# EasyEDA schematic 20210526-8-channel-solid-relay.json

## Sheets
1 SolidRelays: TITLE: Sheet_1; REV: 1.0; Date: 2021-05-26; Sheet: 1/1; Drawn By: Suresh Kumar Gadi; Company: Your Company
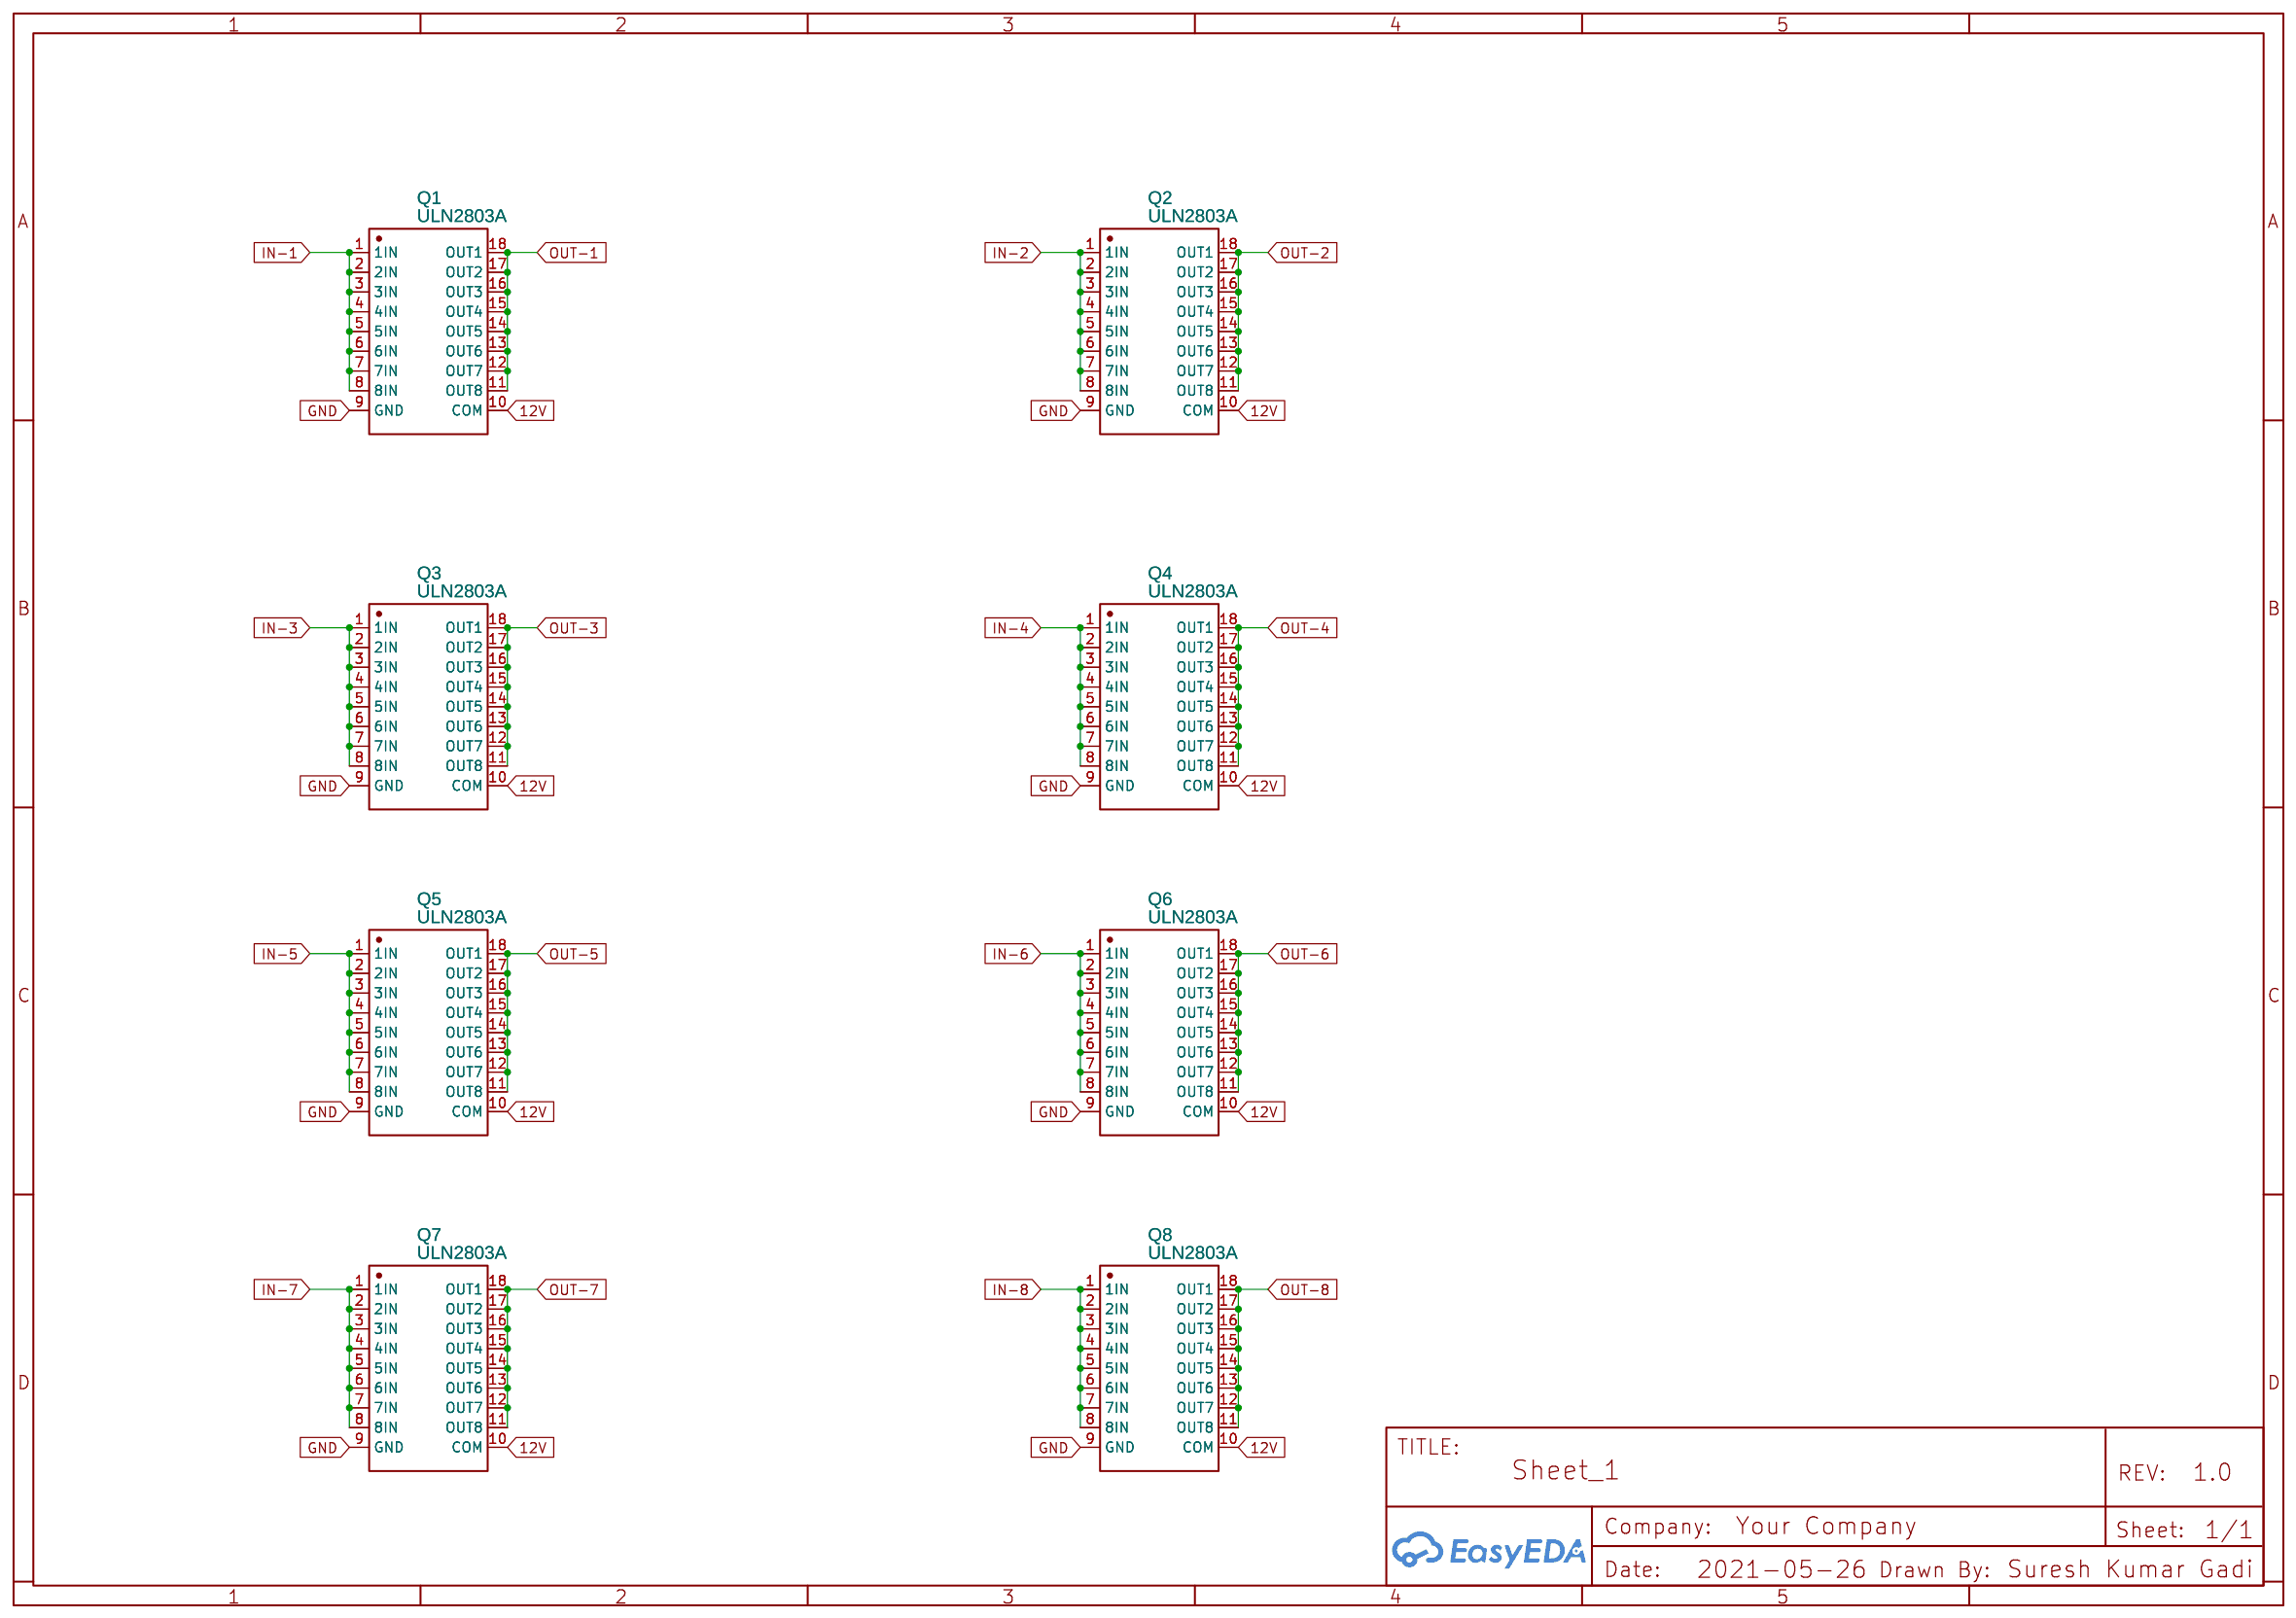
[diagram p0: SolidRelays]
2 Connectors
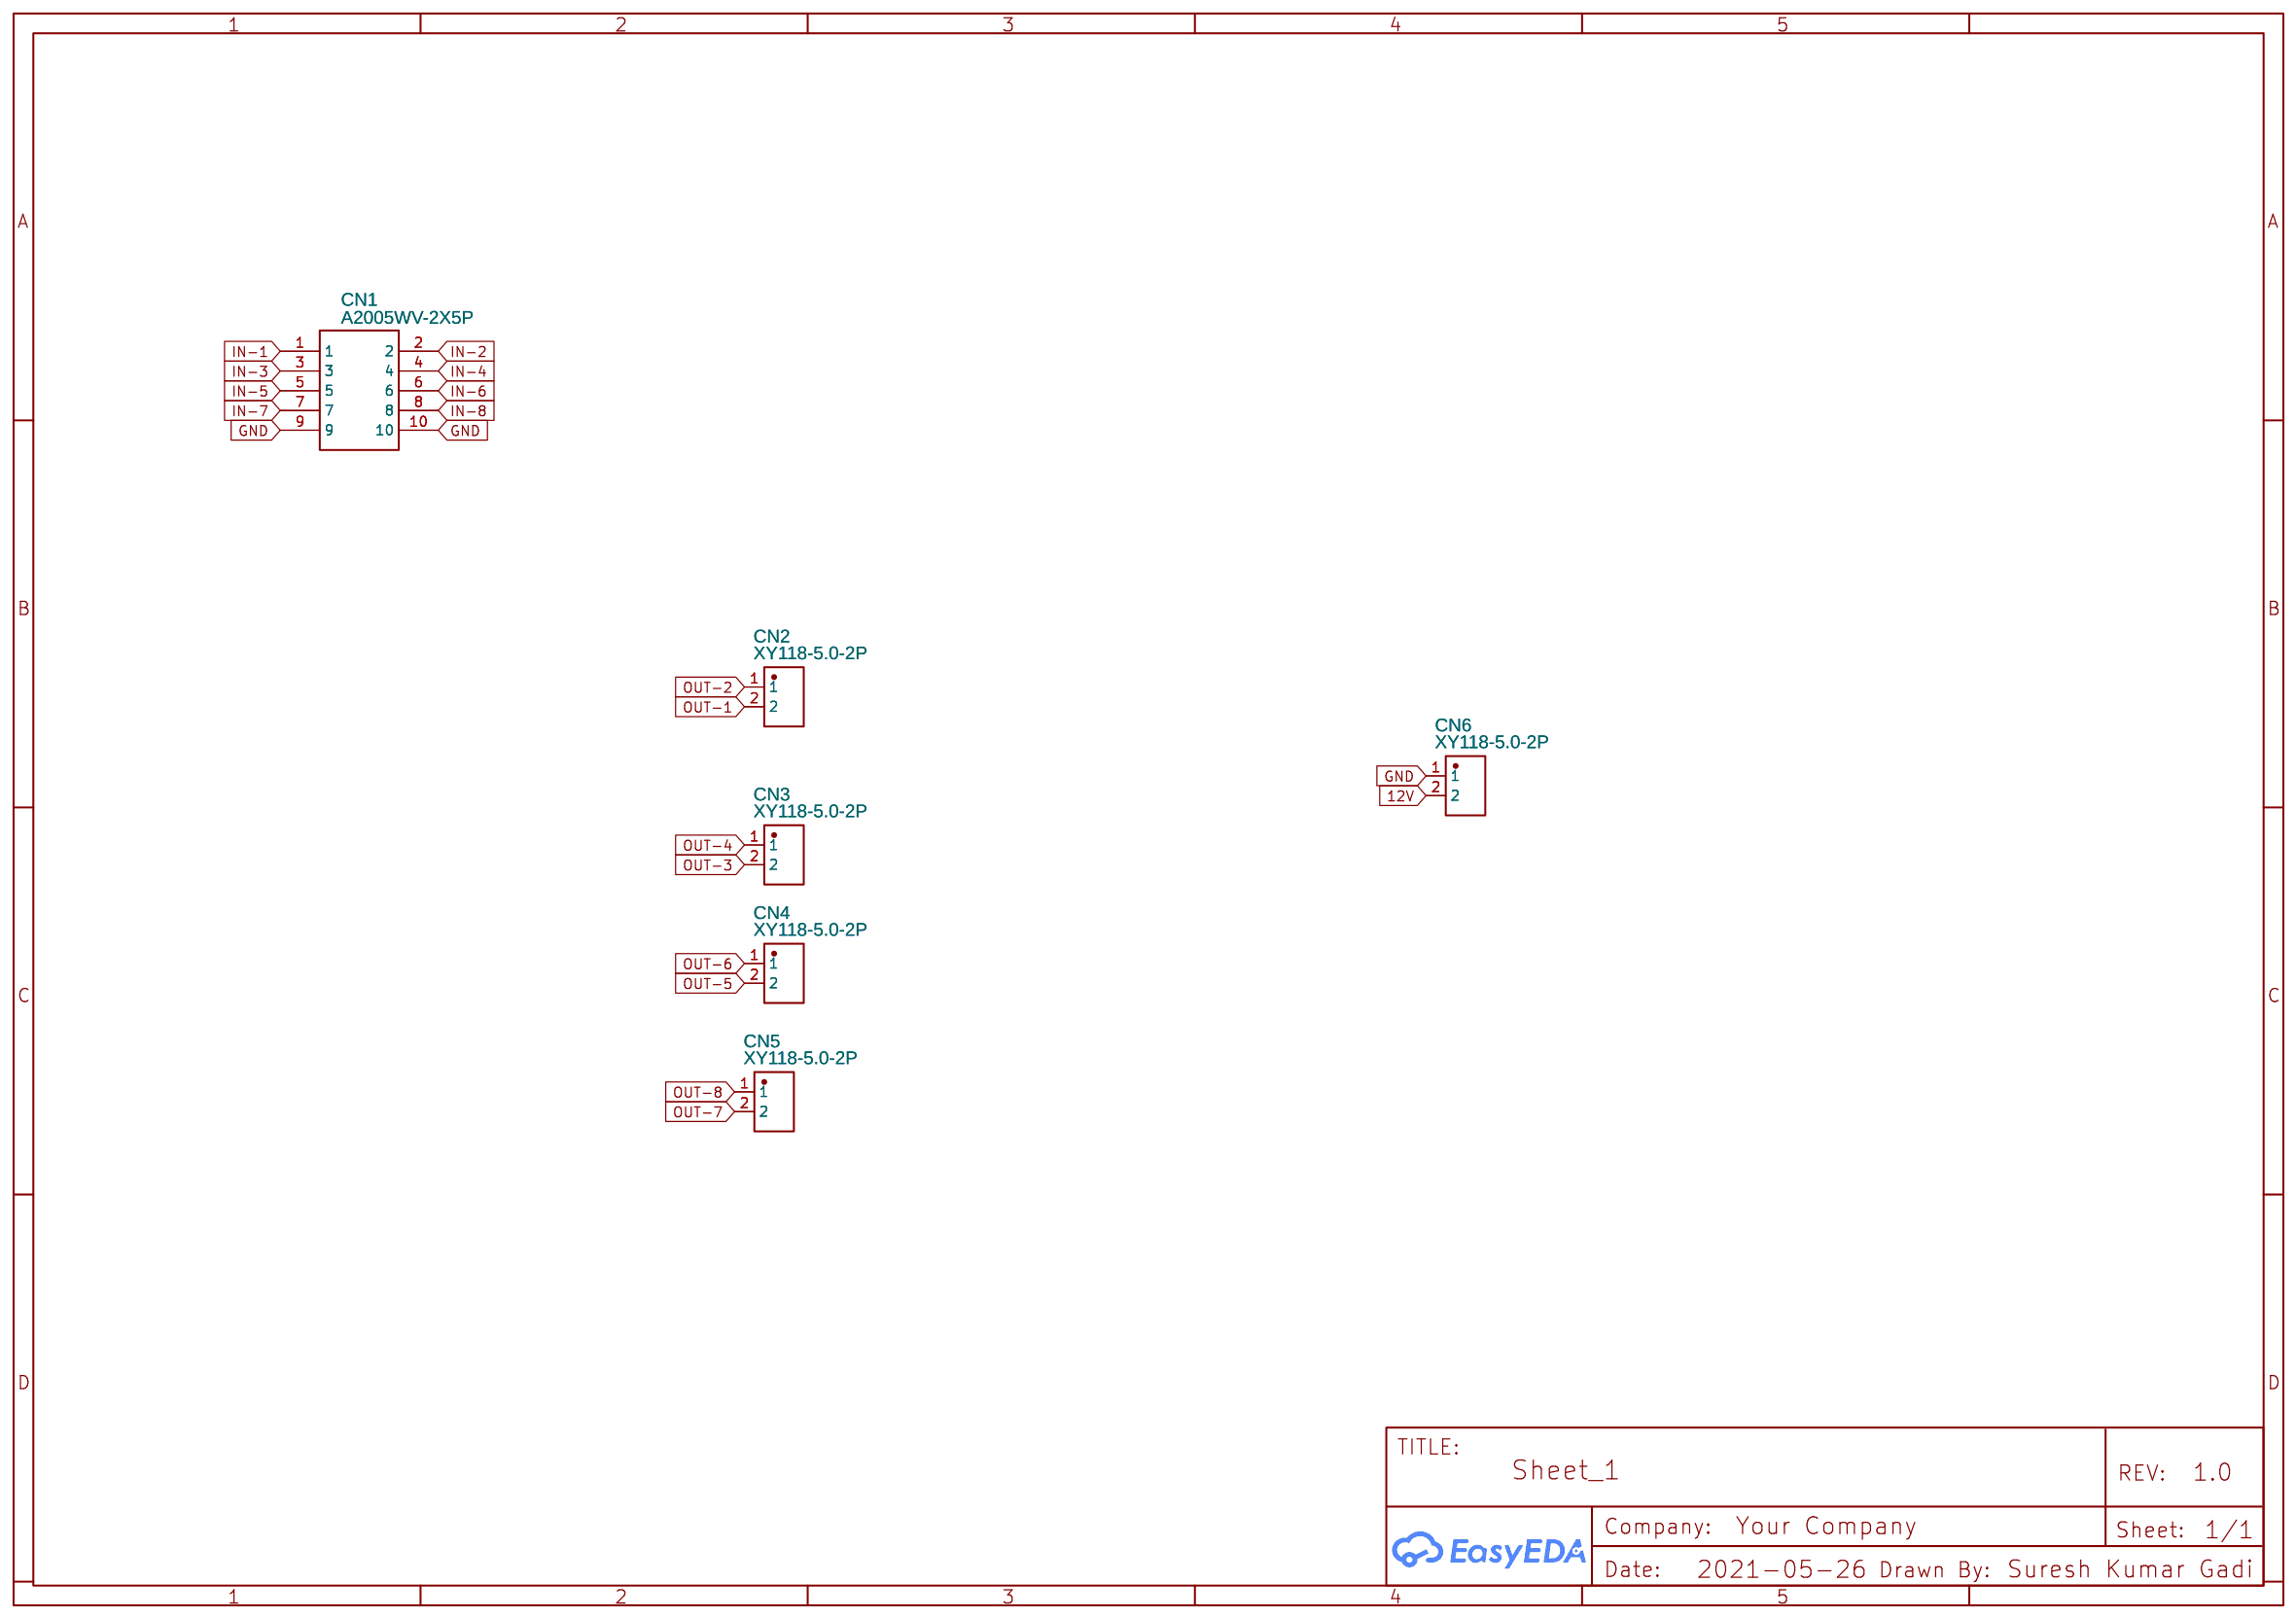
[diagram p1: Connectors]

## Parts
sheet Connectors
CN1  A2005WV-2X5P  [HDR-TH_10P-P2.00-V-R2-C5-S2.00]
CN2  XY118-5.0-2P  [CONN-TH_XY118-5.0-2P]
CN3  XY118-5.0-2P  [CONN-TH_XY118-5.0-2P]
CN4  XY118-5.0-2P  [CONN-TH_XY118-5.0-2P]
CN5  XY118-5.0-2P  [CONN-TH_XY118-5.0-2P]
CN6  XY118-5.0-2P  [CONN-TH_XY118-5.0-2P]
sheet SolidRelays
Q1  ULN2803A  [DIP-18_L23.0-W6.5-P2.54-LS7.6-BL]
Q2  ULN2803A  [DIP-18_L23.0-W6.5-P2.54-LS7.6-BL]
Q3  ULN2803A  [DIP-18_L23.0-W6.5-P2.54-LS7.6-BL]
Q4  ULN2803A  [DIP-18_L23.0-W6.5-P2.54-LS7.6-BL]
Q5  ULN2803A  [DIP-18_L23.0-W6.5-P2.54-LS7.6-BL]
Q6  ULN2803A  [DIP-18_L23.0-W6.5-P2.54-LS7.6-BL]
Q7  ULN2803A  [DIP-18_L23.0-W6.5-P2.54-LS7.6-BL]
Q8  ULN2803A  [DIP-18_L23.0-W6.5-P2.54-LS7.6-BL]

## Library data of the parts
CN1 = A2005WV-2X5P: Supplier: LCSC; Supplier Part: C225290; Manufacturer: Changjiang Connectors; Manufacturer Part: A2005WV-2x5P; Contributor: LCSC; JLCPCB Part Class: Extended Part
CN2-CN6 = XY118-5.0-2P: Supplier: LCSC; Supplier Part: C784922; Manufacturer: Ningbo Xinlaiya Elec.; Contributor: LCSC; JLCPCB Part Class: Extended Part
Q1-Q8 = ULN2803A: Supplier: LCSC; Manufacturer: STMicroelectronics; Supplier Part: C73936; JLCPCB Part Class: Extended Part

## Nets
12V: CN6.2 Q1.10(COM) Q2.10(COM) Q3.10(COM) Q4.10(COM) Q5.10(COM) Q6.10(COM) Q7.10(COM) Q8.10(COM)
GND: CN1.9 CN1.10 CN6.1 Q1.9(GND) Q2.9(GND) Q3.9(GND) Q4.9(GND) Q5.9(GND) Q6.9(GND) Q7.9(GND) Q8.9(GND)
IN-1: CN1.1 Q1.1(1IN) Q1.2(2IN) Q1.3(3IN) Q1.4(4IN) Q1.5(5IN) Q1.6(6IN) Q1.7(7IN) Q1.8(8IN)
IN-2: CN1.2 Q2.1(1IN) Q2.2(2IN) Q2.3(3IN) Q2.4(4IN) Q2.5(5IN) Q2.6(6IN) Q2.7(7IN) Q2.8(8IN)
IN-3: CN1.3 Q3.1(1IN) Q3.2(2IN) Q3.3(3IN) Q3.4(4IN) Q3.5(5IN) Q3.6(6IN) Q3.7(7IN) Q3.8(8IN)
IN-4: CN1.4 Q4.1(1IN) Q4.2(2IN) Q4.3(3IN) Q4.4(4IN) Q4.5(5IN) Q4.6(6IN) Q4.7(7IN) Q4.8(8IN)
IN-5: CN1.5 Q5.1(1IN) Q5.2(2IN) Q5.3(3IN) Q5.4(4IN) Q5.5(5IN) Q5.6(6IN) Q5.7(7IN) Q5.8(8IN)
IN-6: CN1.6 Q6.1(1IN) Q6.2(2IN) Q6.3(3IN) Q6.4(4IN) Q6.5(5IN) Q6.6(6IN) Q6.7(7IN) Q6.8(8IN)
IN-7: CN1.7 Q7.1(1IN) Q7.2(2IN) Q7.3(3IN) Q7.4(4IN) Q7.5(5IN) Q7.6(6IN) Q7.7(7IN) Q7.8(8IN)
IN-8: CN1.8 Q8.1(1IN) Q8.2(2IN) Q8.3(3IN) Q8.4(4IN) Q8.5(5IN) Q8.6(6IN) Q8.7(7IN) Q8.8(8IN)
OUT-1: CN2.2 Q1.11(OUT8) Q1.12(OUT7) Q1.13(OUT6) Q1.14(OUT5) Q1.15(OUT4) Q1.16(OUT3) Q1.17(OUT2) Q1.18(OUT1)
OUT-2: CN2.1 Q2.11(OUT8) Q2.12(OUT7) Q2.13(OUT6) Q2.14(OUT5) Q2.15(OUT4) Q2.16(OUT3) Q2.17(OUT2) Q2.18(OUT1)
OUT-3: CN3.2 Q3.11(OUT8) Q3.12(OUT7) Q3.13(OUT6) Q3.14(OUT5) Q3.15(OUT4) Q3.16(OUT3) Q3.17(OUT2) Q3.18(OUT1)
OUT-4: CN3.1 Q4.11(OUT8) Q4.12(OUT7) Q4.13(OUT6) Q4.14(OUT5) Q4.15(OUT4) Q4.16(OUT3) Q4.17(OUT2) Q4.18(OUT1)
OUT-5: CN4.2 Q5.11(OUT8) Q5.12(OUT7) Q5.13(OUT6) Q5.14(OUT5) Q5.15(OUT4) Q5.16(OUT3) Q5.17(OUT2) Q5.18(OUT1)
OUT-6: CN4.1 Q6.11(OUT8) Q6.12(OUT7) Q6.13(OUT6) Q6.14(OUT5) Q6.15(OUT4) Q6.16(OUT3) Q6.17(OUT2) Q6.18(OUT1)
OUT-7: CN5.2 Q7.11(OUT8) Q7.12(OUT7) Q7.13(OUT6) Q7.14(OUT5) Q7.15(OUT4) Q7.16(OUT3) Q7.17(OUT2) Q7.18(OUT1)
OUT-8: CN5.1 Q8.11(OUT8) Q8.12(OUT7) Q8.13(OUT6) Q8.14(OUT5) Q8.15(OUT4) Q8.16(OUT3) Q8.17(OUT2) Q8.18(OUT1)
